# Altium schematic sheet BMS.SchDoc
size A; SheetNumber: 4; SheetTotal: 5
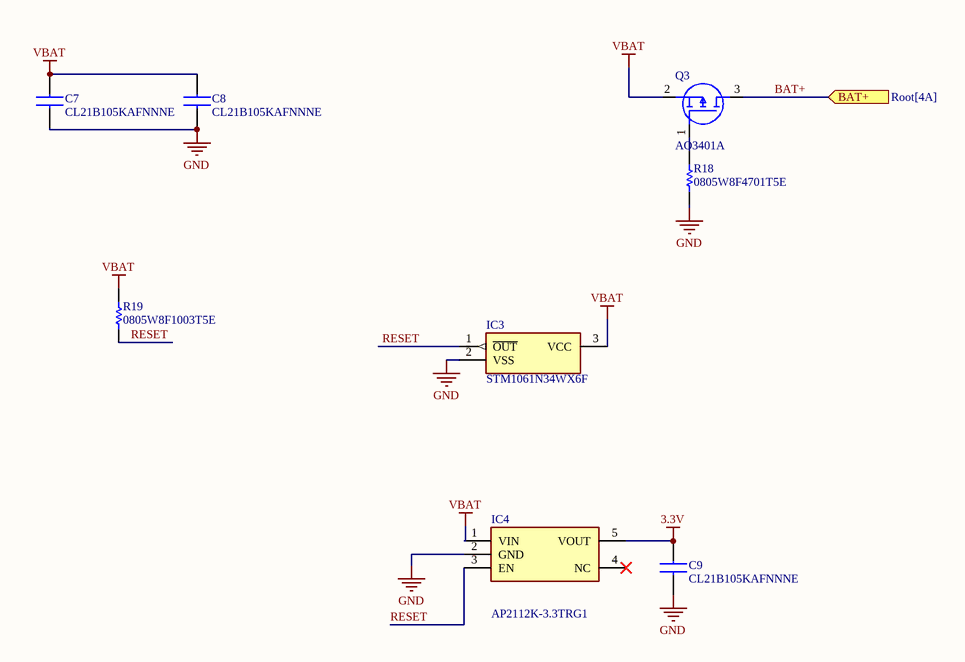
[diagram p0: BMS.SchDoc]

## Parts
C7  CL21B105KAFNNNE  [CAPC2012X135N]
C8  CL21B105KAFNNNE  [CAPC2012X135N]
C9  CL21B105KAFNNNE  [CAPC2012X135N]
IC3  STM1061N34WX6F  [SOT103P237X112-3N]
IC4  AP2112K-3.3TRG1  [SOT95P285X140-5N]
Q3  AO3401A  [SOT95P280X125-3N - duplicate]
R18  0805W8F4701T5E  [RESC2013X65N]
R19  0805W8F1003T5E  [RESC2013X65N - Duplicate2]

## Ports
BAT+ (in, see Root[4A])

## Nets
3.3V: C9.1 IC4.5(VOUT)
GND: C7.2 C8.2 C9.2 IC3.2(VSS) IC4.2(GND) R18.1
VBAT: C7.1 C8.1 IC3.3(VCC) IC4.1(VIN) Q3.2(S) R19.2
BAT+: Q3.3(D) ; port BAT+
RESET: IC3.1(~{OUT}) IC4.3(EN) R19.1
NetQ3_1: Q3.1(G) R18.2

Not connected (* = marked no-connect by the designer): IC4 4(NC)*

## Library data of the parts
C7-C9 = CL21B105KAFNNNE: 1uF, 0805, X7R; Manufacturer_Name: SAMSUNG; Manu Part #: CL21B105KBFNNNE; LCSC Part #: C28323
IC3 = STM1061N34WX6F: 3.4V Voltage Supervisor; Manufacturer_Name: STMicroelectronics; Datasheet Link: https://www.st.com/resource/en/datasheet/stm1061.pdf; Height: 1.12mm; LCSC Part #: C222402; Manu Part #: STM1061N34WX6F
IC4 = AP2112K-3.3TRG1: 3.3V 600mA LDO; Manufacturer_Name: Diodes Incorporated; Height: 1.4mm; Datasheet Link: https://www.diodes.com//assets/Datasheets/AP2112.pdf; LCSC Part #: C51118; Manu Part #: AP2112K-3.3TRG1
Q3 = AO3401A: PMOS 4.2A SOT-23; LCSC Part #: C21266; Manu Part #: AO3401A
R18 = 0805W8F4701T5E: 4.7k 0805 1%; Manufacturer_Name: UNI-ROYAL(Uniroyal Elec); LCSC Part #: C17673; Manu Part #: 0805W8F4701T5E
R19 = 0805W8F1003T5E: 100K, 0805, 1%; Manufacturer_Name: ROYALOHM; Datasheet Link: https://www.mouser.in/datasheet/2/1365/1-3044649.pdf; Height: 0.65mm; LCSC Part #: C149504; Manu Part #: 0805W8F1003T5E